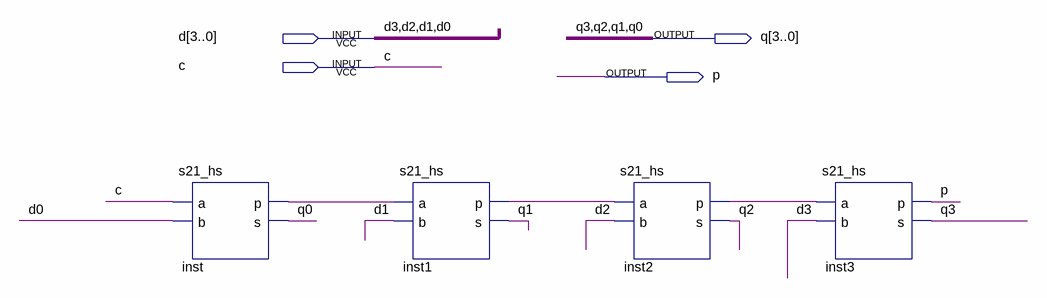
[diagram p0: schematic sheet]
// Quartus schematic s25_inc.bdf as structural Verilog: 4 symbols, 4 pins
module s25_inc (
  input  [3:0] d,
  input  c,
  output [3:0] q,
  output p
);

  wire inst1_p, inst2_p, inst_p;

  s21_hs inst (.a(c), .b(d[0]), .p(inst_p), .s(q[0]));
  s21_hs inst1 (.a(inst_p), .b(d[1]), .p(inst1_p), .s(q[1]));
  s21_hs inst2 (.a(inst1_p), .b(d[2]), .p(inst2_p), .s(q[2]));
  s21_hs inst3 (.a(inst2_p), .b(d[3]), .p(p), .s(q[3]));
endmodule
